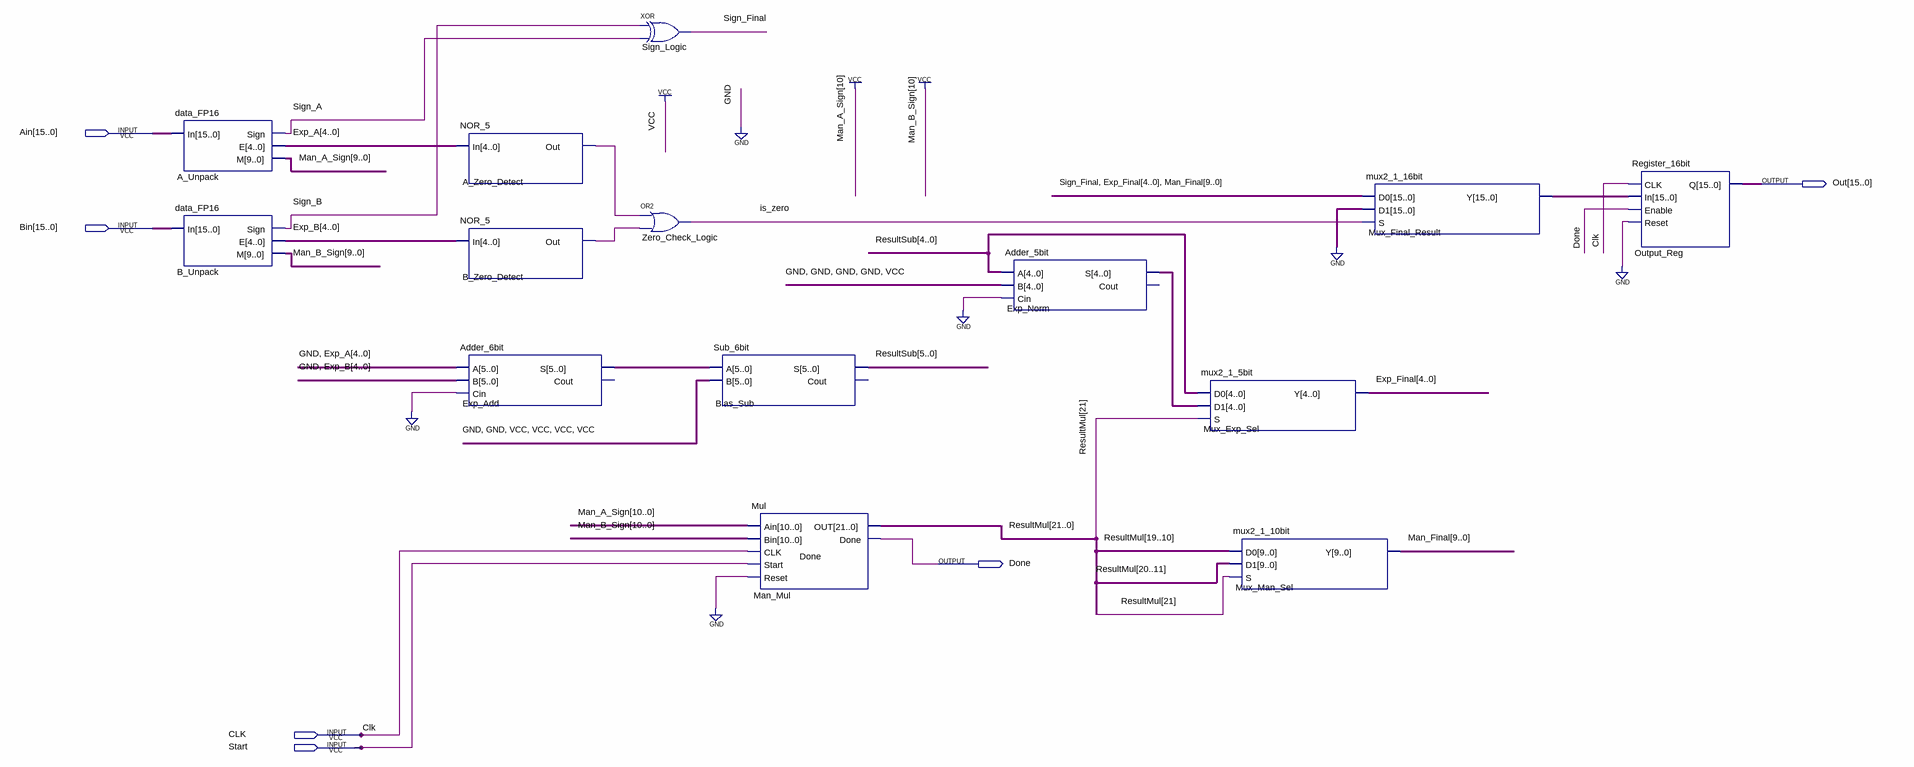
[diagram p0: schematic sheet]
// Quartus schematic MulUnit.bdf as structural Verilog: 14 symbols, 6 pins
module MulUnit (
  input  [15:0] Ain,
  input  [15:0] Bin,
  input  CLK,
  input  Start,
  output [15:0] Out,
  output Done
);

  wire A_Zero_Detect_out, B_Zero_Detect_out, is_zero, Sign_A, Sign_B, Sign_Final;
  wire [4:0] Exp_A, Exp_B, Exp_Final, Exp_Norm_s;
  wire [5:0] Exp_Add_s, ResultSub;
  wire [9:0] Man_A_Sign, Man_B_Sign, Man_Final;
  wire [15:0] Mux_Final_Result_y;
  wire [21:0] ResultMul;

  data_FP16 A_Unpack (.In(Ain), .Sign(Sign_A), .E(Exp_A), .M(Man_A_Sign));
  data_FP16 B_Unpack (.In(Bin), .Sign(Sign_B), .E(Exp_B), .M(Man_B_Sign));
  NOR_5 A_Zero_Detect (.In(Exp_A), .Out(A_Zero_Detect_out));
  NOR_5 B_Zero_Detect (.In(Exp_B), .Out(B_Zero_Detect_out));
  Adder_6bit Exp_Add (.A({1'b0, Exp_A}), .B({1'b0, Exp_B}), .Cin(1'b0), .S(Exp_Add_s));  // open: Cout
  xor Sign_Logic (Sign_Final, Sign_B, Sign_A);
  or Zero_Check_Logic (is_zero, A_Zero_Detect_out, B_Zero_Detect_out);
  Sub_6bit Bias_Sub (.A(Exp_Add_s), .B(6'b001111), .S(ResultSub));  // open: Cout
  Mul Man_Mul (
    .Ain({1'b1, Man_A_Sign}), .Bin({1'b1, Man_B_Sign}), .CLK(CLK), .Start(Start), .Reset(1'b0),
    .OUT(ResultMul), .Done(Done));
  Adder_5bit Exp_Norm (.A(ResultSub[4:0]), .B(5'b00001), .Cin(1'b0), .S(Exp_Norm_s));  // open: Cout
  mux2_1_5bit Mux_Exp_Sel (.D0(ResultSub[4:0]), .D1(Exp_Norm_s), .S(ResultMul[21]), .Y(Exp_Final));
  mux2_1_10bit Mux_Man_Sel (.D0(ResultMul[19:10]), .D1(ResultMul[20:11]), .S(ResultMul[21]), .Y(Man_Final));
  mux2_1_16bit Mux_Final_Result (
    .D0({Sign_Final, Exp_Final, Man_Final}), .D1({16{1'b0}}), .S(is_zero), .Y(Mux_Final_Result_y));
  Register_16bit Output_Reg (.CLK(CLK), .In(Mux_Final_Result_y), .Enable(Done), .Reset(1'b0), .Q(Out));
endmodule
